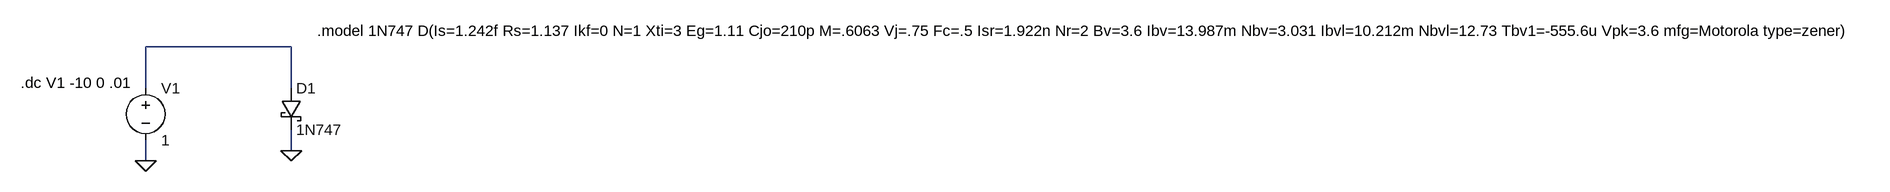
[diagram p0: schematic Lab3_3.asc]
Lab3_3.asc, the LTspice schematic file:
Version 4
SHEET 1 3012 680
WIRE 320 64 96 64
WIRE 96 128 96 64
WIRE 320 128 320 64
WIRE 320 224 320 192
WIRE 96 240 96 208
FLAG 96 240 0
FLAG 320 224 0
SYMBOL voltage 96 112 R0
SYMATTR InstName V1
SYMATTR Value 1
SYMBOL schottky 304 128 R0
SYMATTR InstName D1
SYMATTR Value 1N747
SYMATTR Description Diode
SYMATTR Type diode
TEXT -96 120 Left 2 !.dc V1 -10 0 .01
TEXT 360 40 Left 2 !.model 1N747 D(Is=1.242f Rs=1.137 Ikf=0 N=1 Xti=3 Eg=1.11 Cjo=210p M=.6063 Vj=.75 Fc=.5 Isr=1.922n Nr=2 Bv=3.6 Ibv=13.987m Nbv=3.031 Ibvl=10.212m Nbvl=12.73 Tbv1=-555.6u Vpk=3.6 mfg=Motorola type=zener)

The netlist it stands for:
* Lab3_3.asc
V1 N001 0 1
D1 N001 0 1N747
.model D D
.lib standard.dio
.dc V1 -10 0 .01
.model 1N747 D(Is=1.242f Rs=1.137 Ikf=0 N=1 Xti=3 Eg=1.11 Cjo=210p M=.6063 Vj=.75 Fc=.5 Isr=1.922n Nr=2 Bv=3.6 Ibv=13.987m Nbv=3.031 Ibvl=10.212m Nbvl=12.73 Tbv1=-555.6u Vpk=3.6 mfg=Motorola type=zener)
.backanno
.end